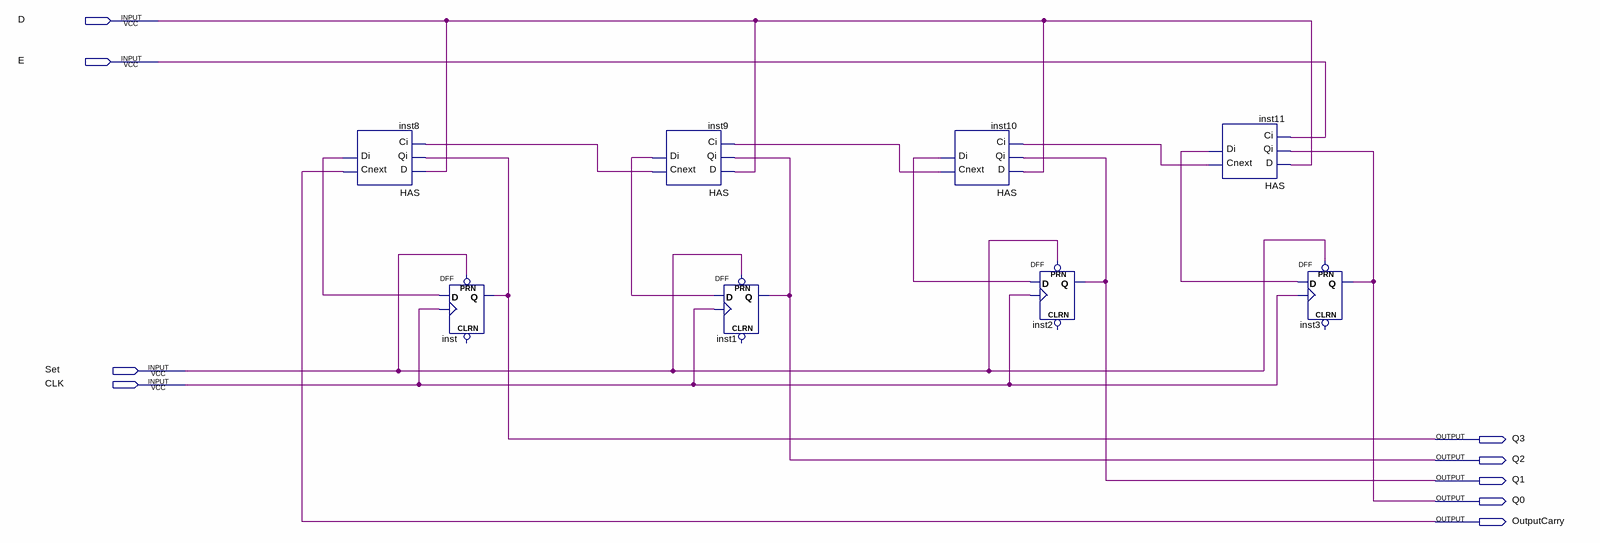
[diagram p0: schematic sheet]
// Quartus schematic CounterUp_Down_set.bdf as structural Verilog: 8 symbols, 9 pins
module CounterUp_Down_set (
  input  D,
  input  E,
  input  Set,
  input  CLK,
  output Q3,
  output Q2,
  output Q1,
  output Q0,
  output OutputCarry
);

  wire inst8_di, inst9_cnext, inst9_di, inst10_cnext, inst10_di, inst11_cnext, inst11_di;

  HAS inst8 (.D(D), .Qi(Q3), .Ci(inst9_cnext), .Cnext(OutputCarry), .Di(inst8_di));
  DFF inst (.CLK(CLK), .D(inst8_di), .PRN(Set), .Q(Q3));  // open: CLRN
  HAS inst9 (.D(D), .Qi(Q2), .Ci(inst10_cnext), .Cnext(inst9_cnext), .Di(inst9_di));
  DFF inst1 (.CLK(CLK), .D(inst9_di), .PRN(Set), .Q(Q2));  // open: CLRN
  HAS inst10 (.D(D), .Qi(Q1), .Ci(inst11_cnext), .Cnext(inst10_cnext), .Di(inst10_di));
  DFF inst2 (.CLK(CLK), .D(inst10_di), .PRN(Set), .Q(Q1));  // open: CLRN
  HAS inst11 (.D(D), .Qi(Q0), .Ci(E), .Cnext(inst11_cnext), .Di(inst11_di));
  DFF inst3 (.CLK(CLK), .D(inst11_di), .PRN(Set), .Q(Q0));  // open: CLRN
endmodule
